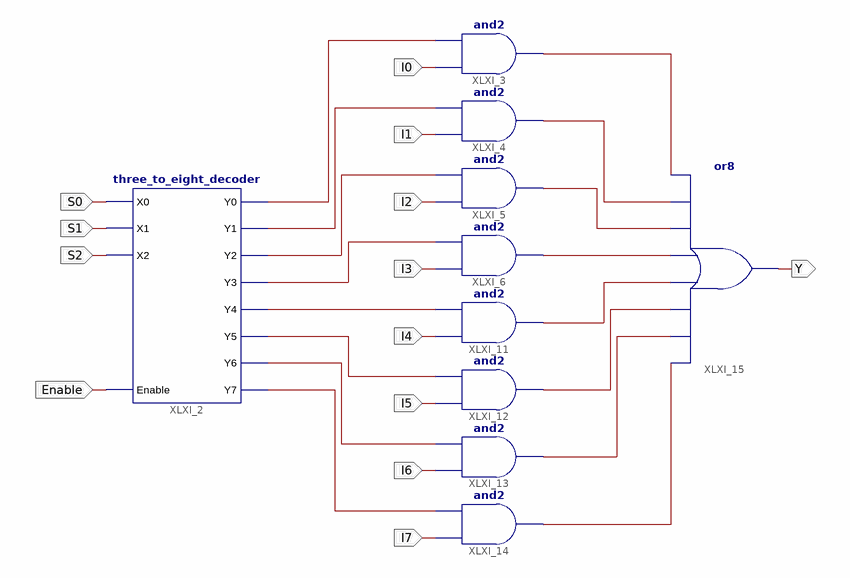
[diagram p0: schematic sheet 1]
// Xilinx ISE schematic eight_to_one_mux.sch (spartan6) as structural Verilog: 10 symbols, 13 ports
module eight_to_one_mux (
  input  I0,
  input  I1,
  input  I2,
  input  I3,
  input  I4,
  input  I5,
  input  I6,
  input  I7,
  input  S0,
  input  S1,
  input  S2,
  input  Enable,
  output Y
);

  wire XLXN_1, XLXN_2, XLXN_3, XLXN_4, XLXN_6, XLXN_7, XLXN_8, XLXN_9, XLXN_51, XLXN_53, XLXN_54, XLXN_55,
       XLXN_56, XLXN_57, XLXN_58, XLXN_59;

  three_to_eight_decoder XLXI_2 (
    .X0(S0), .X1(S1), .X2(S2), .Y0(XLXN_1), .Y1(XLXN_2), .Y2(XLXN_3), .Y3(XLXN_4), .Y4(XLXN_6), .Y5(XLXN_7),
    .Y6(XLXN_8), .Y7(XLXN_9), .Enable(Enable));
  and XLXI_3 (XLXN_53, I0, XLXN_1);
  and XLXI_4 (XLXN_51, I1, XLXN_2);
  and XLXI_5 (XLXN_54, I2, XLXN_3);
  and XLXI_6 (XLXN_55, I3, XLXN_4);
  and XLXI_11 (XLXN_56, I4, XLXN_6);
  and XLXI_12 (XLXN_57, I5, XLXN_7);
  and XLXI_13 (XLXN_58, I6, XLXN_8);
  and XLXI_14 (XLXN_59, I7, XLXN_9);
  or XLXI_15 (Y, XLXN_59, XLXN_58, XLXN_57, XLXN_56, XLXN_55, XLXN_54, XLXN_51, XLXN_53);
endmodule
